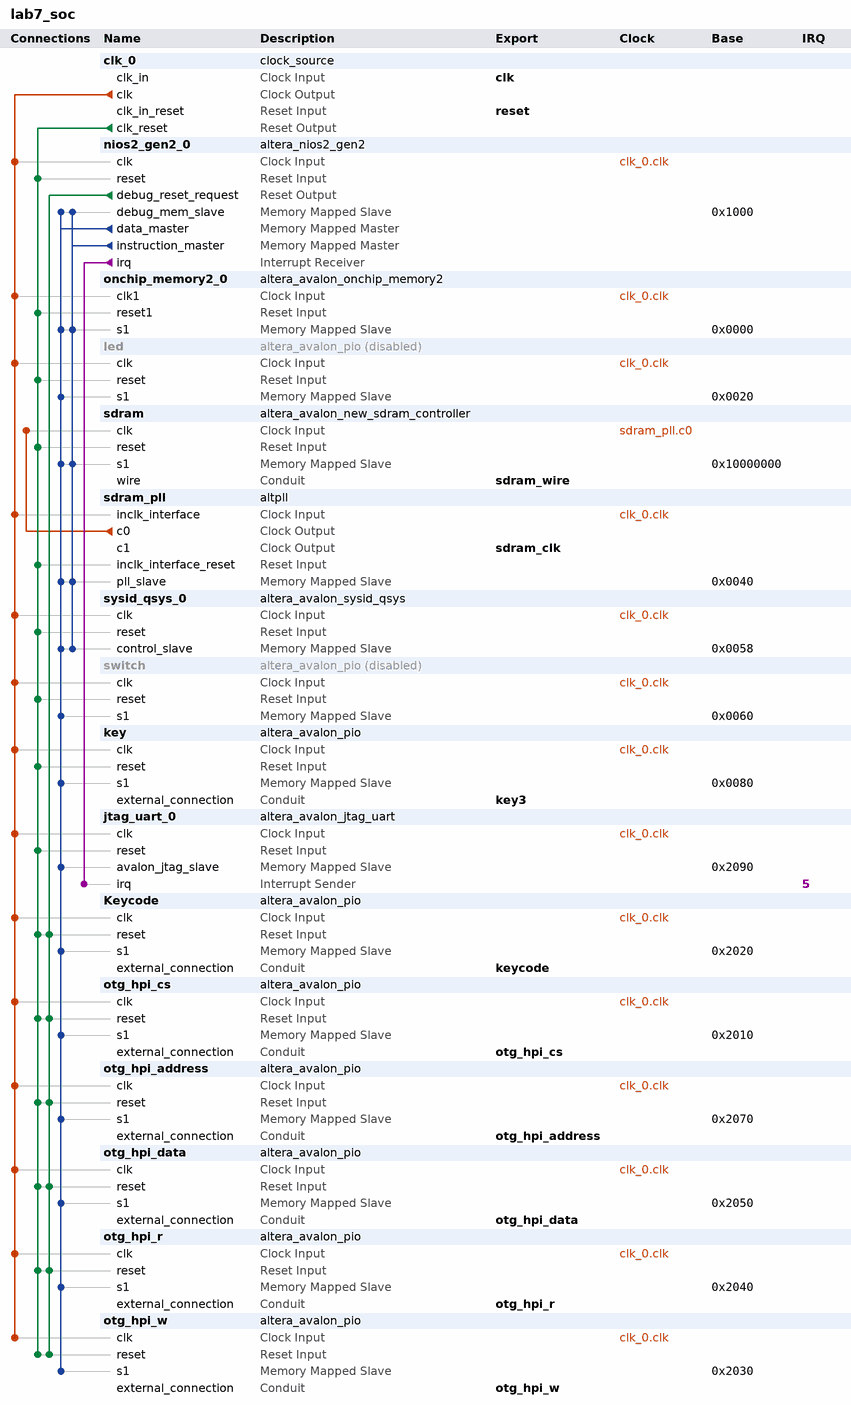
[diagram p0: system contents]
# Platform Designer (Qsys) system lab7_soc, Cyclone IV E EP4CE115F29C7
# Parameters at their usual value, and those the tool derives, are not listed.
package require -exact qsys 15.0
create_system lab7_soc
set_project_property DEVICE_FAMILY {Cyclone IV E}
set_project_property DEVICE EP4CE115F29C7

add_instance clk_0 clock_source 15.0
set_instance_parameter_value clk_0 clockFrequency 50000000

add_instance nios2_gen2_0 altera_nios2_gen2 15.0
set_instance_parameter_value nios2_gen2_0 dcache_size 2048
set_instance_parameter_value nios2_gen2_0 exceptionSlave sdram.s1
set_instance_parameter_value nios2_gen2_0 icache_size 4096
set_instance_parameter_value nios2_gen2_0 impl Tiny
set_instance_parameter_value nios2_gen2_0 resetSlave sdram.s1

add_instance onchip_memory2_0 altera_avalon_onchip_memory2 15.0
set_instance_parameter_value onchip_memory2_0 dataWidth 32
set_instance_parameter_value onchip_memory2_0 dualPort false
set_instance_parameter_value onchip_memory2_0 initMemContent true
set_instance_parameter_value onchip_memory2_0 initializationFileName onchip_mem.hex
set_instance_parameter_value onchip_memory2_0 memorySize 16

add_instance led altera_avalon_pio 15.0
set_instance_property led ENABLED false
set_instance_parameter_value led direction Output
set_instance_parameter_value led width 8

add_instance sdram altera_avalon_new_sdram_controller 15.0
set_instance_parameter_value sdram TAC 5.5
set_instance_parameter_value sdram TRCD 20.0
set_instance_parameter_value sdram TRP 20.0
set_instance_parameter_value sdram casLatency 3
set_instance_parameter_value sdram columnWidth 10
set_instance_parameter_value sdram dataWidth 32
set_instance_parameter_value sdram generateSimulationModel false
set_instance_parameter_value sdram model single_Micron_MT48LC4M32B2_7_chip
set_instance_parameter_value sdram numberOfBanks 4
set_instance_parameter_value sdram numberOfChipSelects 1
set_instance_parameter_value sdram powerUpDelay 200.0
set_instance_parameter_value sdram refreshPeriod 7.8125
set_instance_parameter_value sdram rowWidth 13

add_instance sdram_pll altpll 15.0
set_instance_parameter_value sdram_pll CLK0_DIVIDE_BY 1
set_instance_parameter_value sdram_pll CLK0_MULTIPLY_BY 1
set_instance_parameter_value sdram_pll CLK1_DIVIDE_BY 1
set_instance_parameter_value sdram_pll CLK1_DUTY_CYCLE 50
set_instance_parameter_value sdram_pll CLK1_MULTIPLY_BY 1
set_instance_parameter_value sdram_pll CLK1_PHASE_SHIFT -3000
set_instance_parameter_value sdram_pll INCLK0_INPUT_FREQUENCY 20000
set_instance_parameter_value sdram_pll PORT_ARESET PORT_UNUSED
set_instance_parameter_value sdram_pll PORT_LOCKED PORT_UNUSED
set_instance_parameter_value sdram_pll PORT_clk1 PORT_USED
set_instance_parameter_value sdram_pll PORT_clk2 PORT_UNUSED
set_instance_parameter_value sdram_pll PORT_clk3 PORT_UNUSED

add_instance sysid_qsys_0 altera_avalon_sysid_qsys 15.0
set_instance_parameter_value sysid_qsys_0 id 0

add_instance switch altera_avalon_pio 15.0
set_instance_property switch ENABLED false
set_instance_parameter_value switch direction Input
set_instance_parameter_value switch width 8

add_instance key altera_avalon_pio 15.0
set_instance_parameter_value key direction Input
set_instance_parameter_value key width 8

add_instance jtag_uart_0 altera_avalon_jtag_uart 15.0
set_instance_parameter_value jtag_uart_0 simInteractiveOptions NO_INTERACTIVE_WINDOWS

add_instance Keycode altera_avalon_pio 15.0
set_instance_parameter_value Keycode direction Output
set_instance_parameter_value Keycode width 16

add_instance otg_hpi_cs altera_avalon_pio 15.0
set_instance_parameter_value otg_hpi_cs direction Output
set_instance_parameter_value otg_hpi_cs width 1

add_instance otg_hpi_address altera_avalon_pio 15.0
set_instance_parameter_value otg_hpi_address direction Output
set_instance_parameter_value otg_hpi_address width 2

add_instance otg_hpi_data altera_avalon_pio 15.0
set_instance_parameter_value otg_hpi_data direction InOut
set_instance_parameter_value otg_hpi_data width 16

add_instance otg_hpi_r altera_avalon_pio 15.0
set_instance_parameter_value otg_hpi_r direction Output
set_instance_parameter_value otg_hpi_r width 1

add_instance otg_hpi_w altera_avalon_pio 15.0
set_instance_parameter_value otg_hpi_w direction Output
set_instance_parameter_value otg_hpi_w width 1

# connections
add_connection clk_0.clk jtag_uart_0.clk clock
add_connection clk_0.clk key.clk clock
add_connection clk_0.clk Keycode.clk clock
add_connection clk_0.clk led.clk clock
add_connection clk_0.clk nios2_gen2_0.clk clock
add_connection clk_0.clk onchip_memory2_0.clk1 clock
add_connection clk_0.clk otg_hpi_address.clk clock
add_connection clk_0.clk otg_hpi_cs.clk clock
add_connection clk_0.clk otg_hpi_data.clk clock
add_connection clk_0.clk otg_hpi_r.clk clock
add_connection clk_0.clk otg_hpi_w.clk clock
add_connection clk_0.clk sdram_pll.inclk_interface clock
add_connection clk_0.clk switch.clk clock
add_connection clk_0.clk sysid_qsys_0.clk clock
add_connection sdram_pll.c0 sdram.clk clock
add_connection clk_0.clk_reset jtag_uart_0.reset reset
add_connection clk_0.clk_reset key.reset reset
add_connection clk_0.clk_reset Keycode.reset reset
add_connection clk_0.clk_reset led.reset reset
add_connection clk_0.clk_reset nios2_gen2_0.reset reset
add_connection clk_0.clk_reset onchip_memory2_0.reset1 reset
add_connection clk_0.clk_reset otg_hpi_address.reset reset
add_connection clk_0.clk_reset otg_hpi_cs.reset reset
add_connection clk_0.clk_reset otg_hpi_data.reset reset
add_connection clk_0.clk_reset otg_hpi_r.reset reset
add_connection clk_0.clk_reset otg_hpi_w.reset reset
add_connection clk_0.clk_reset sdram.reset reset
add_connection clk_0.clk_reset sdram_pll.inclk_interface_reset reset
add_connection clk_0.clk_reset switch.reset reset
add_connection clk_0.clk_reset sysid_qsys_0.reset reset
add_connection nios2_gen2_0.debug_reset_request Keycode.reset reset
add_connection nios2_gen2_0.debug_reset_request otg_hpi_address.reset reset
add_connection nios2_gen2_0.debug_reset_request otg_hpi_cs.reset reset
add_connection nios2_gen2_0.debug_reset_request otg_hpi_data.reset reset
add_connection nios2_gen2_0.debug_reset_request otg_hpi_r.reset reset
add_connection nios2_gen2_0.debug_reset_request otg_hpi_w.reset reset
add_connection nios2_gen2_0.data_master jtag_uart_0.avalon_jtag_slave avalon
set_connection_parameter_value nios2_gen2_0.data_master/jtag_uart_0.avalon_jtag_slave baseAddress 0x2090
add_connection nios2_gen2_0.data_master key.s1 avalon
set_connection_parameter_value nios2_gen2_0.data_master/key.s1 baseAddress 0x0080
add_connection nios2_gen2_0.data_master Keycode.s1 avalon
set_connection_parameter_value nios2_gen2_0.data_master/Keycode.s1 baseAddress 0x2020
add_connection nios2_gen2_0.data_master led.s1 avalon
set_connection_parameter_value nios2_gen2_0.data_master/led.s1 baseAddress 0x0020
add_connection nios2_gen2_0.data_master nios2_gen2_0.debug_mem_slave avalon
set_connection_parameter_value nios2_gen2_0.data_master/nios2_gen2_0.debug_mem_slave baseAddress 0x1000
add_connection nios2_gen2_0.data_master onchip_memory2_0.s1 avalon
set_connection_parameter_value nios2_gen2_0.data_master/onchip_memory2_0.s1 baseAddress 0x0000
add_connection nios2_gen2_0.data_master otg_hpi_address.s1 avalon
set_connection_parameter_value nios2_gen2_0.data_master/otg_hpi_address.s1 baseAddress 0x2070
add_connection nios2_gen2_0.data_master otg_hpi_cs.s1 avalon
set_connection_parameter_value nios2_gen2_0.data_master/otg_hpi_cs.s1 baseAddress 0x2010
add_connection nios2_gen2_0.data_master otg_hpi_data.s1 avalon
set_connection_parameter_value nios2_gen2_0.data_master/otg_hpi_data.s1 baseAddress 0x2050
add_connection nios2_gen2_0.data_master otg_hpi_r.s1 avalon
set_connection_parameter_value nios2_gen2_0.data_master/otg_hpi_r.s1 baseAddress 0x2040
add_connection nios2_gen2_0.data_master otg_hpi_w.s1 avalon
set_connection_parameter_value nios2_gen2_0.data_master/otg_hpi_w.s1 baseAddress 0x2030
add_connection nios2_gen2_0.data_master sdram.s1 avalon
set_connection_parameter_value nios2_gen2_0.data_master/sdram.s1 baseAddress 0x10000000
add_connection nios2_gen2_0.data_master sdram_pll.pll_slave avalon
set_connection_parameter_value nios2_gen2_0.data_master/sdram_pll.pll_slave baseAddress 0x0040
add_connection nios2_gen2_0.data_master switch.s1 avalon
set_connection_parameter_value nios2_gen2_0.data_master/switch.s1 baseAddress 0x0060
add_connection nios2_gen2_0.data_master sysid_qsys_0.control_slave avalon
set_connection_parameter_value nios2_gen2_0.data_master/sysid_qsys_0.control_slave baseAddress 0x0058
add_connection nios2_gen2_0.instruction_master nios2_gen2_0.debug_mem_slave avalon
set_connection_parameter_value nios2_gen2_0.instruction_master/nios2_gen2_0.debug_mem_slave baseAddress 0x1000
add_connection nios2_gen2_0.instruction_master onchip_memory2_0.s1 avalon
set_connection_parameter_value nios2_gen2_0.instruction_master/onchip_memory2_0.s1 baseAddress 0x0000
add_connection nios2_gen2_0.instruction_master sdram.s1 avalon
set_connection_parameter_value nios2_gen2_0.instruction_master/sdram.s1 baseAddress 0x10000000
add_connection nios2_gen2_0.instruction_master sdram_pll.pll_slave avalon
set_connection_parameter_value nios2_gen2_0.instruction_master/sdram_pll.pll_slave baseAddress 0x0040
add_connection nios2_gen2_0.instruction_master sysid_qsys_0.control_slave avalon
set_connection_parameter_value nios2_gen2_0.instruction_master/sysid_qsys_0.control_slave baseAddress 0x0058
add_connection nios2_gen2_0.irq jtag_uart_0.irq interrupt
set_connection_parameter_value nios2_gen2_0.irq/jtag_uart_0.irq irqNumber 5

# exported interfaces
add_interface clk clock sink
set_interface_property clk EXPORT_OF clk_0.clk_in
add_interface key3 conduit end
set_interface_property key3 EXPORT_OF key.external_connection
add_interface keycode conduit end
set_interface_property keycode EXPORT_OF Keycode.external_connection
add_interface otg_hpi_address conduit end
set_interface_property otg_hpi_address EXPORT_OF otg_hpi_address.external_connection
add_interface otg_hpi_cs conduit end
set_interface_property otg_hpi_cs EXPORT_OF otg_hpi_cs.external_connection
add_interface otg_hpi_data conduit end
set_interface_property otg_hpi_data EXPORT_OF otg_hpi_data.external_connection
add_interface otg_hpi_r conduit end
set_interface_property otg_hpi_r EXPORT_OF otg_hpi_r.external_connection
add_interface otg_hpi_w conduit end
set_interface_property otg_hpi_w EXPORT_OF otg_hpi_w.external_connection
add_interface reset reset sink
set_interface_property reset EXPORT_OF clk_0.clk_in_reset
add_interface sdram_clk clock source
set_interface_property sdram_clk EXPORT_OF sdram_pll.c1
add_interface sdram_wire conduit end
set_interface_property sdram_wire EXPORT_OF sdram.wire

set_interconnect_requirement {$system} qsys_mm.clockCrossingAdapter HANDSHAKE
set_interconnect_requirement {$system} qsys_mm.enableEccProtection FALSE
set_interconnect_requirement {$system} qsys_mm.insertDefaultSlave FALSE
set_interconnect_requirement {$system} qsys_mm.maxAdditionalLatency 1

save_system lab7_soc.qsys
